# EAGLE schematic VCAMatrix (EAGLE 7.7.0)

## Sheet 1 of 2
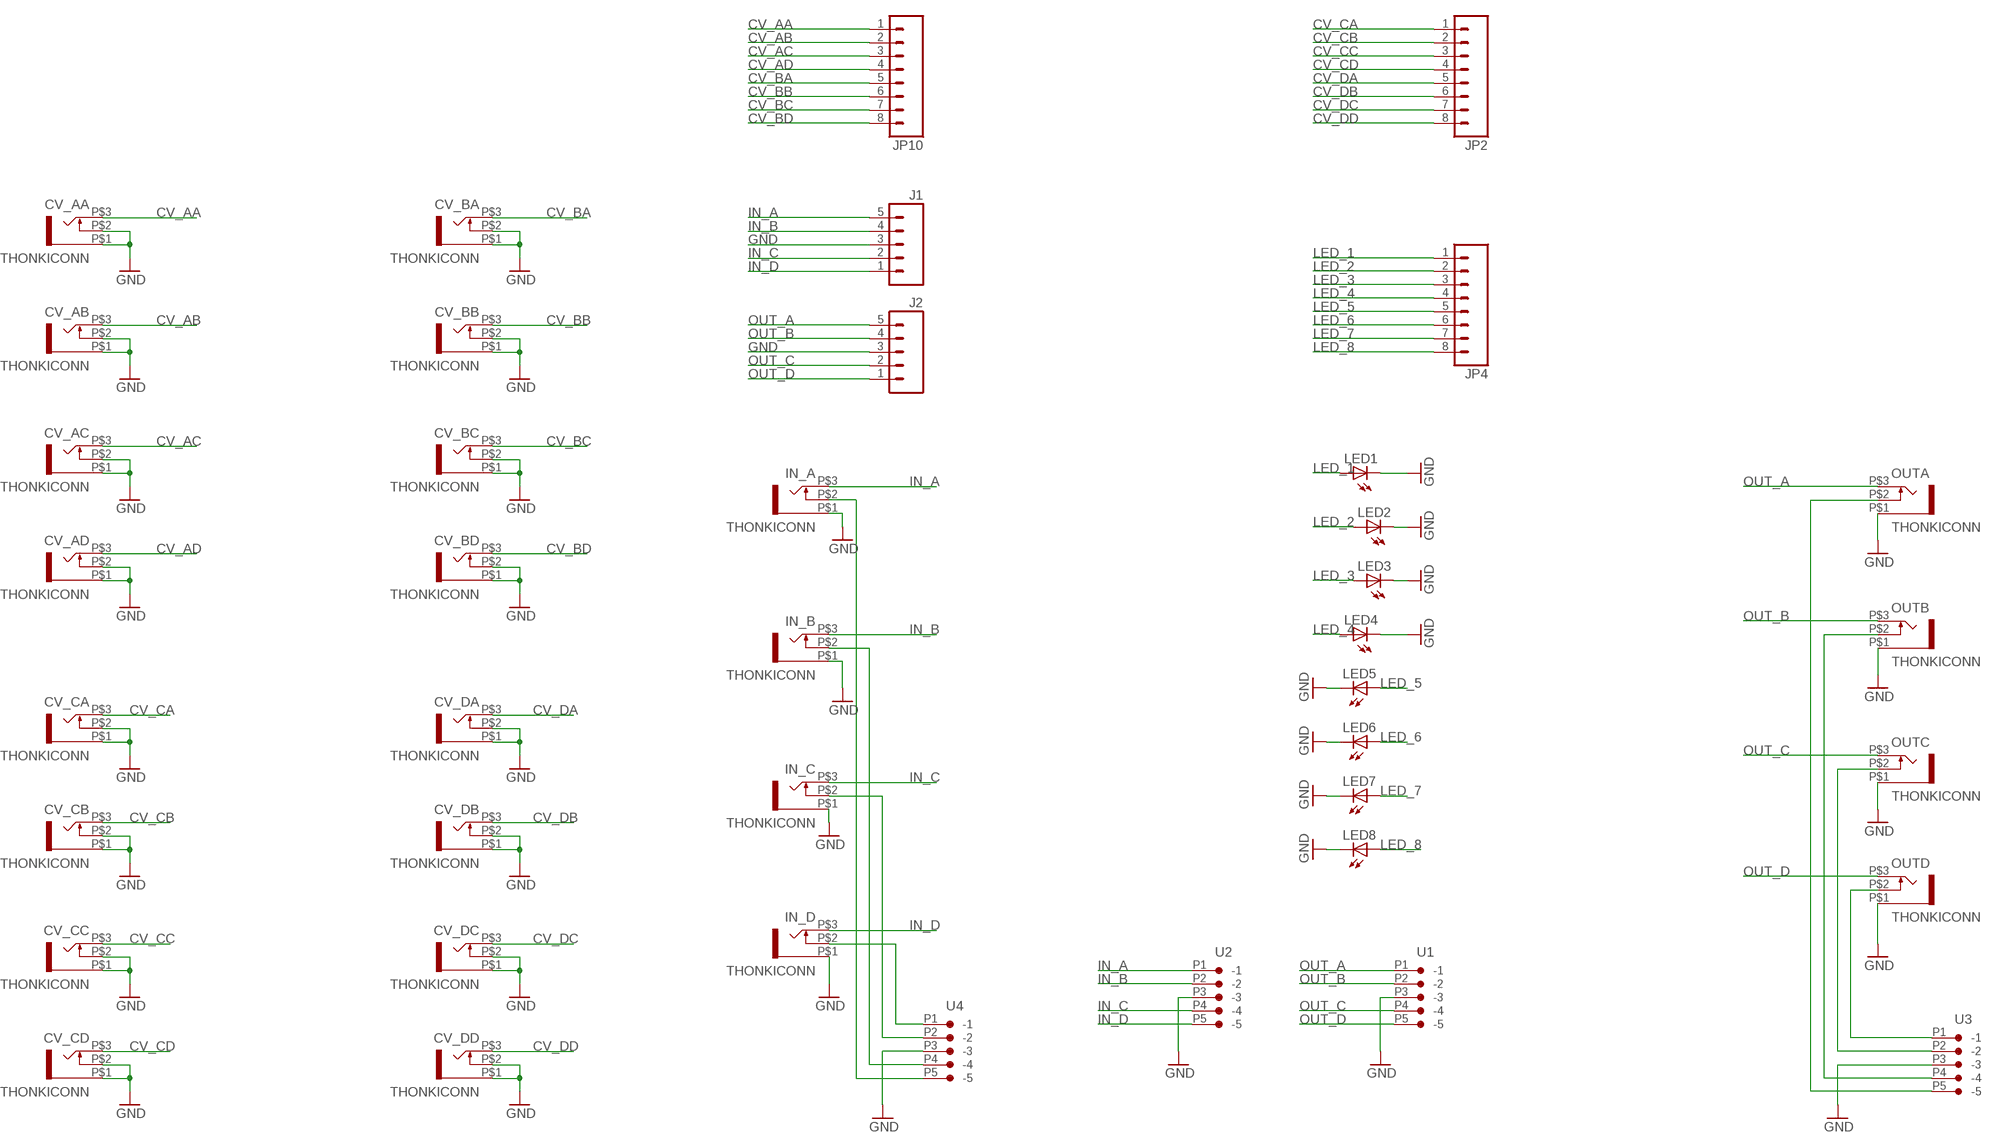
[diagram p0: schematic, sheet 1]

### Parts
CV_AA  THONKICONN  [THONKICONN]
CV_AB  THONKICONN  [THONKICONN]
CV_AC  THONKICONN  [THONKICONN]
CV_AD  THONKICONN  [THONKICONN]
CV_BA  THONKICONN  [THONKICONN]
CV_BB  THONKICONN  [THONKICONN]
CV_BC  THONKICONN  [THONKICONN]
CV_BD  THONKICONN  [THONKICONN]
CV_CA  THONKICONN  [THONKICONN]
CV_CB  THONKICONN  [THONKICONN]
CV_CC  THONKICONN  [THONKICONN]
CV_CD  THONKICONN  [THONKICONN]
CV_DA  THONKICONN  [THONKICONN]
CV_DB  THONKICONN  [THONKICONN]
CV_DC  THONKICONN  [THONKICONN]
CV_DD  THONKICONN  [THONKICONN]
IN_A  THONKICONN  [THONKICONN]
IN_B  THONKICONN  [THONKICONN]
IN_C  THONKICONN  [THONKICONN]
IN_D  THONKICONN  [THONKICONN]
J1  M05PTH  [1X05]
J2  M05PTH  [1X05]
JP2  M081X08  [1X08]
JP4  M081X08  [1X08]
JP10  M081X08  [1X08]
LED1  LED3MM  [LED3MM]
LED2  LED3MM  [LED3MM]
LED3  LED3MM  [LED3MM]
LED4  LED3MM  [LED3MM]
LED5  LED3MM  [LED3MM]
LED6  LED3MM  [LED3MM]
LED7  LED3MM  [LED3MM]
LED8  LED3MM  [LED3MM]
OUTA  THONKICONN  [THONKICONN]
OUTB  THONKICONN  [THONKICONN]
OUTC  THONKICONN  [THONKICONN]
OUTD  THONKICONN  [THONKICONN]
U1  CON-JST_PH_5W  [CON-JST_PH_5W]
U2  CON-JST_PH_5W  [CON-JST_PH_5W]
U3  CON-JST_PH_5W  [CON-JST_PH_5W]
U4  CON-JST_PH_5W  [CON-JST_PH_5W]

### Nets
CV_AA: CV_AA.P$3 JP10.1 ; also sheet 2
CV_AB: CV_AB.P$3 JP10.2 ; also sheet 2
CV_AC: CV_AC.P$3 JP10.3 ; also sheet 2
CV_AD: CV_AD.P$3 JP10.4 ; also sheet 2
CV_BA: CV_BA.P$3 JP10.5 ; also sheet 2
CV_BB: CV_BB.P$3 JP10.6 ; also sheet 2
CV_BC: CV_BC.P$3 JP10.7 ; also sheet 2
CV_BD: CV_BD.P$3 JP10.8 ; also sheet 2
CV_CA: CV_CA.P$3 JP2.1 ; also sheet 2
CV_CB: CV_CB.P$3 JP2.2 ; also sheet 2
CV_CC: CV_CC.P$3 JP2.3 ; also sheet 2
CV_CD: CV_CD.P$3 JP2.4 ; also sheet 2
CV_DA: CV_DA.P$3 JP2.5 ; also sheet 2
CV_DB: CV_DB.P$3 JP2.6 ; also sheet 2
CV_DC: CV_DC.P$3 JP2.7 ; also sheet 2
CV_DD: CV_DD.P$3 JP2.8 ; also sheet 2
GND: CV_AA.P$1 CV_AA.P$2 CV_AB.P$1 CV_AB.P$2 CV_AC.P$1 CV_AC.P$2 CV_AD.P$1 CV_AD.P$2 CV_BA.P$1 CV_BA.P$2 CV_BB.P$1 CV_BB.P$2 CV_BC.P$1 CV_BC.P$2 CV_BD.P$1 CV_BD.P$2 CV_CA.P$1 CV_CA.P$2 CV_CB.P$1 CV_CB.P$2 CV_CC.P$1 CV_CC.P$2 CV_CD.P$1 CV_CD.P$2 CV_DA.P$1 CV_DA.P$2 CV_DB.P$1 CV_DB.P$2 CV_DC.P$1 CV_DC.P$2 CV_DD.P$1 CV_DD.P$2 IN_A.P$1 IN_B.P$1 IN_C.P$1 IN_D.P$1 J1.3 J2.3 LED1.K(C) LED2.K(C) LED3.K(C) LED4.K(C) LED5.K(C) LED6.K(C) LED7.K(C) LED8.K(C) OUTA.P$1 OUTB.P$1 OUTC.P$1 OUTD.P$1 U1.P3(-3) U2.P3(-3) U3.P3(-3) U4.P3(-3) ; also sheet 2
IN_A: IN_A.P$3 J1.5 U2.P1(-1) ; also sheet 2
IN_B: IN_B.P$3 J1.4 U2.P2(-2) ; also sheet 2
IN_C: IN_C.P$3 J1.2 U2.P4(-4) ; also sheet 2
IN_D: IN_D.P$3 J1.1 U2.P5(-5) ; also sheet 2
LED_1: JP4.1 LED1.A ; also sheet 2
LED_2: JP4.2 LED2.A ; also sheet 2
LED_3: JP4.3 LED3.A ; also sheet 2
LED_4: JP4.4 LED4.A ; also sheet 2
LED_5: JP4.5 LED5.A ; also sheet 2
LED_6: JP4.6 LED6.A ; also sheet 2
LED_7: JP4.7 LED7.A ; also sheet 2
LED_8: JP4.8 LED8.A ; also sheet 2
N$55: OUTA.P$2 U3.P5(-5)
N$70: IN_B.P$2 U4.P4(-4)
N$71: IN_C.P$2 U4.P2(-2)
N$72: IN_D.P$2 U4.P1(-1)
N$73: OUTB.P$2 U3.P4(-4)
N$74: OUTC.P$2 U3.P2(-2)
N$75: OUTD.P$2 U3.P1(-1)
N$76: IN_A.P$2 U4.P5(-5)
OUT_A: J2.5 OUTA.P$3 U1.P1(-1) ; also sheet 2
OUT_B: J2.4 OUTB.P$3 U1.P2(-2) ; also sheet 2
OUT_C: J2.2 OUTC.P$3 U1.P4(-4) ; also sheet 2
OUT_D: J2.1 OUTD.P$3 U1.P5(-5) ; also sheet 2

## Sheet 2 of 2
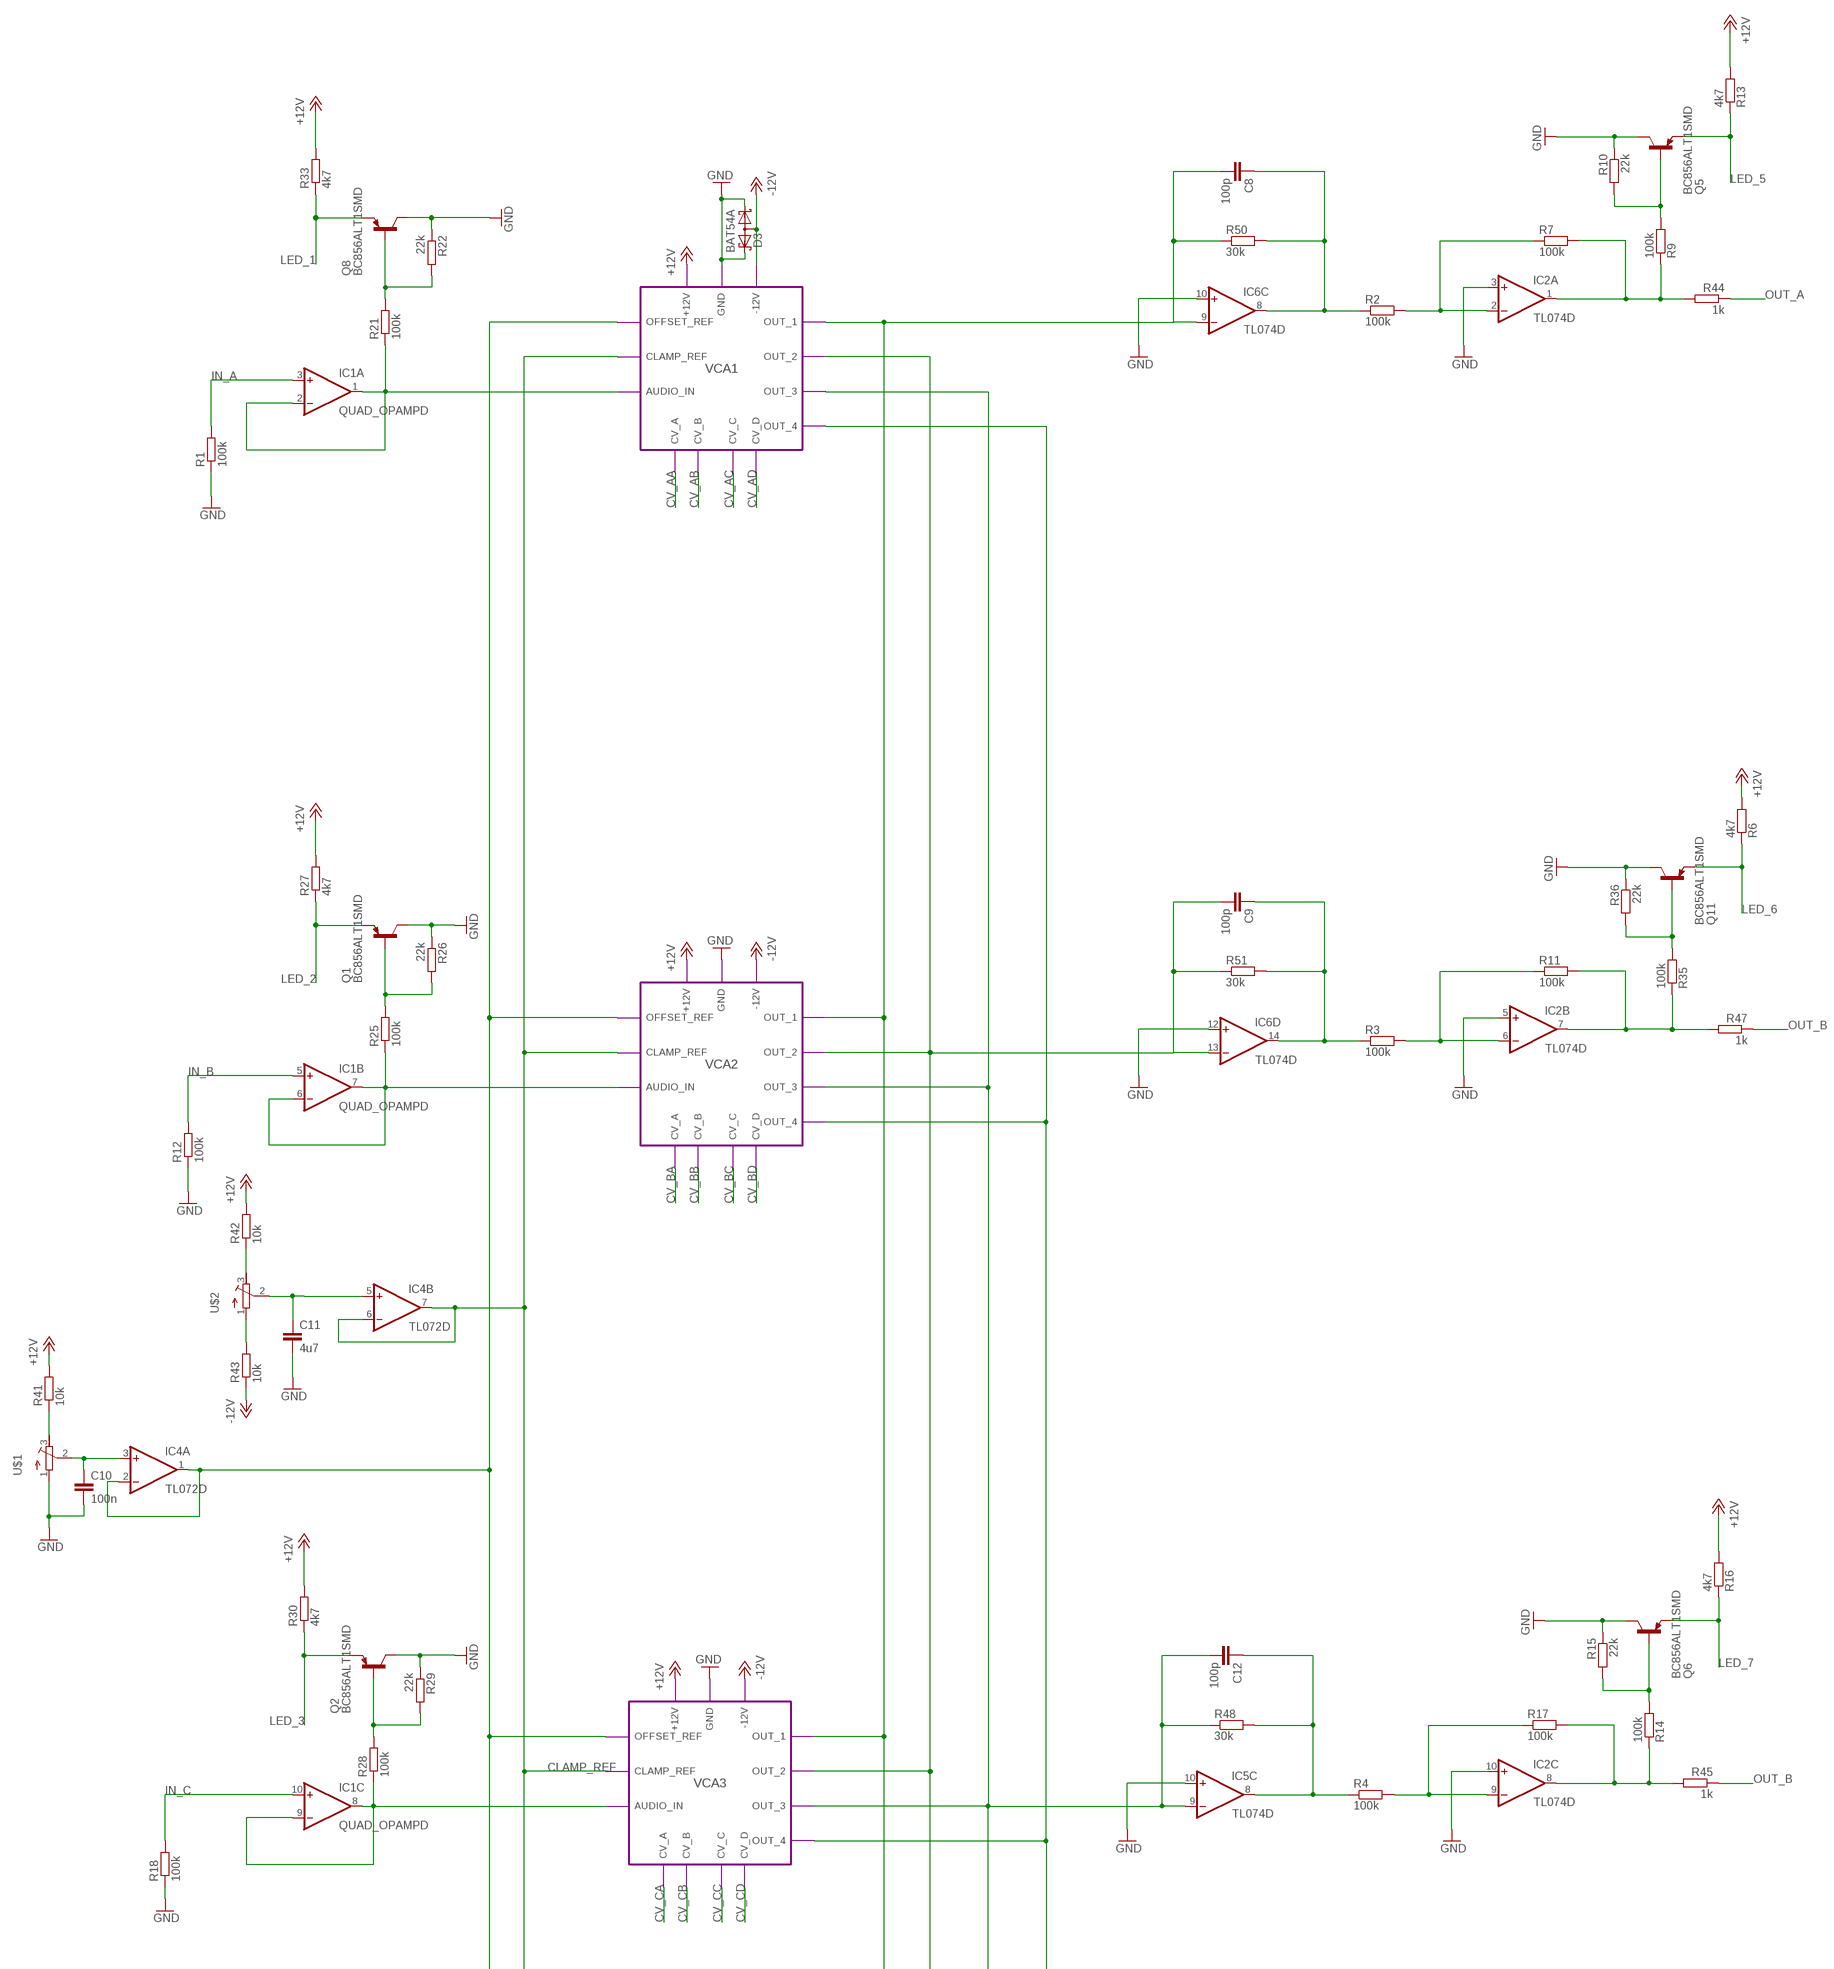
[diagram p1: schematic, sheet 2, part 1 of 2]
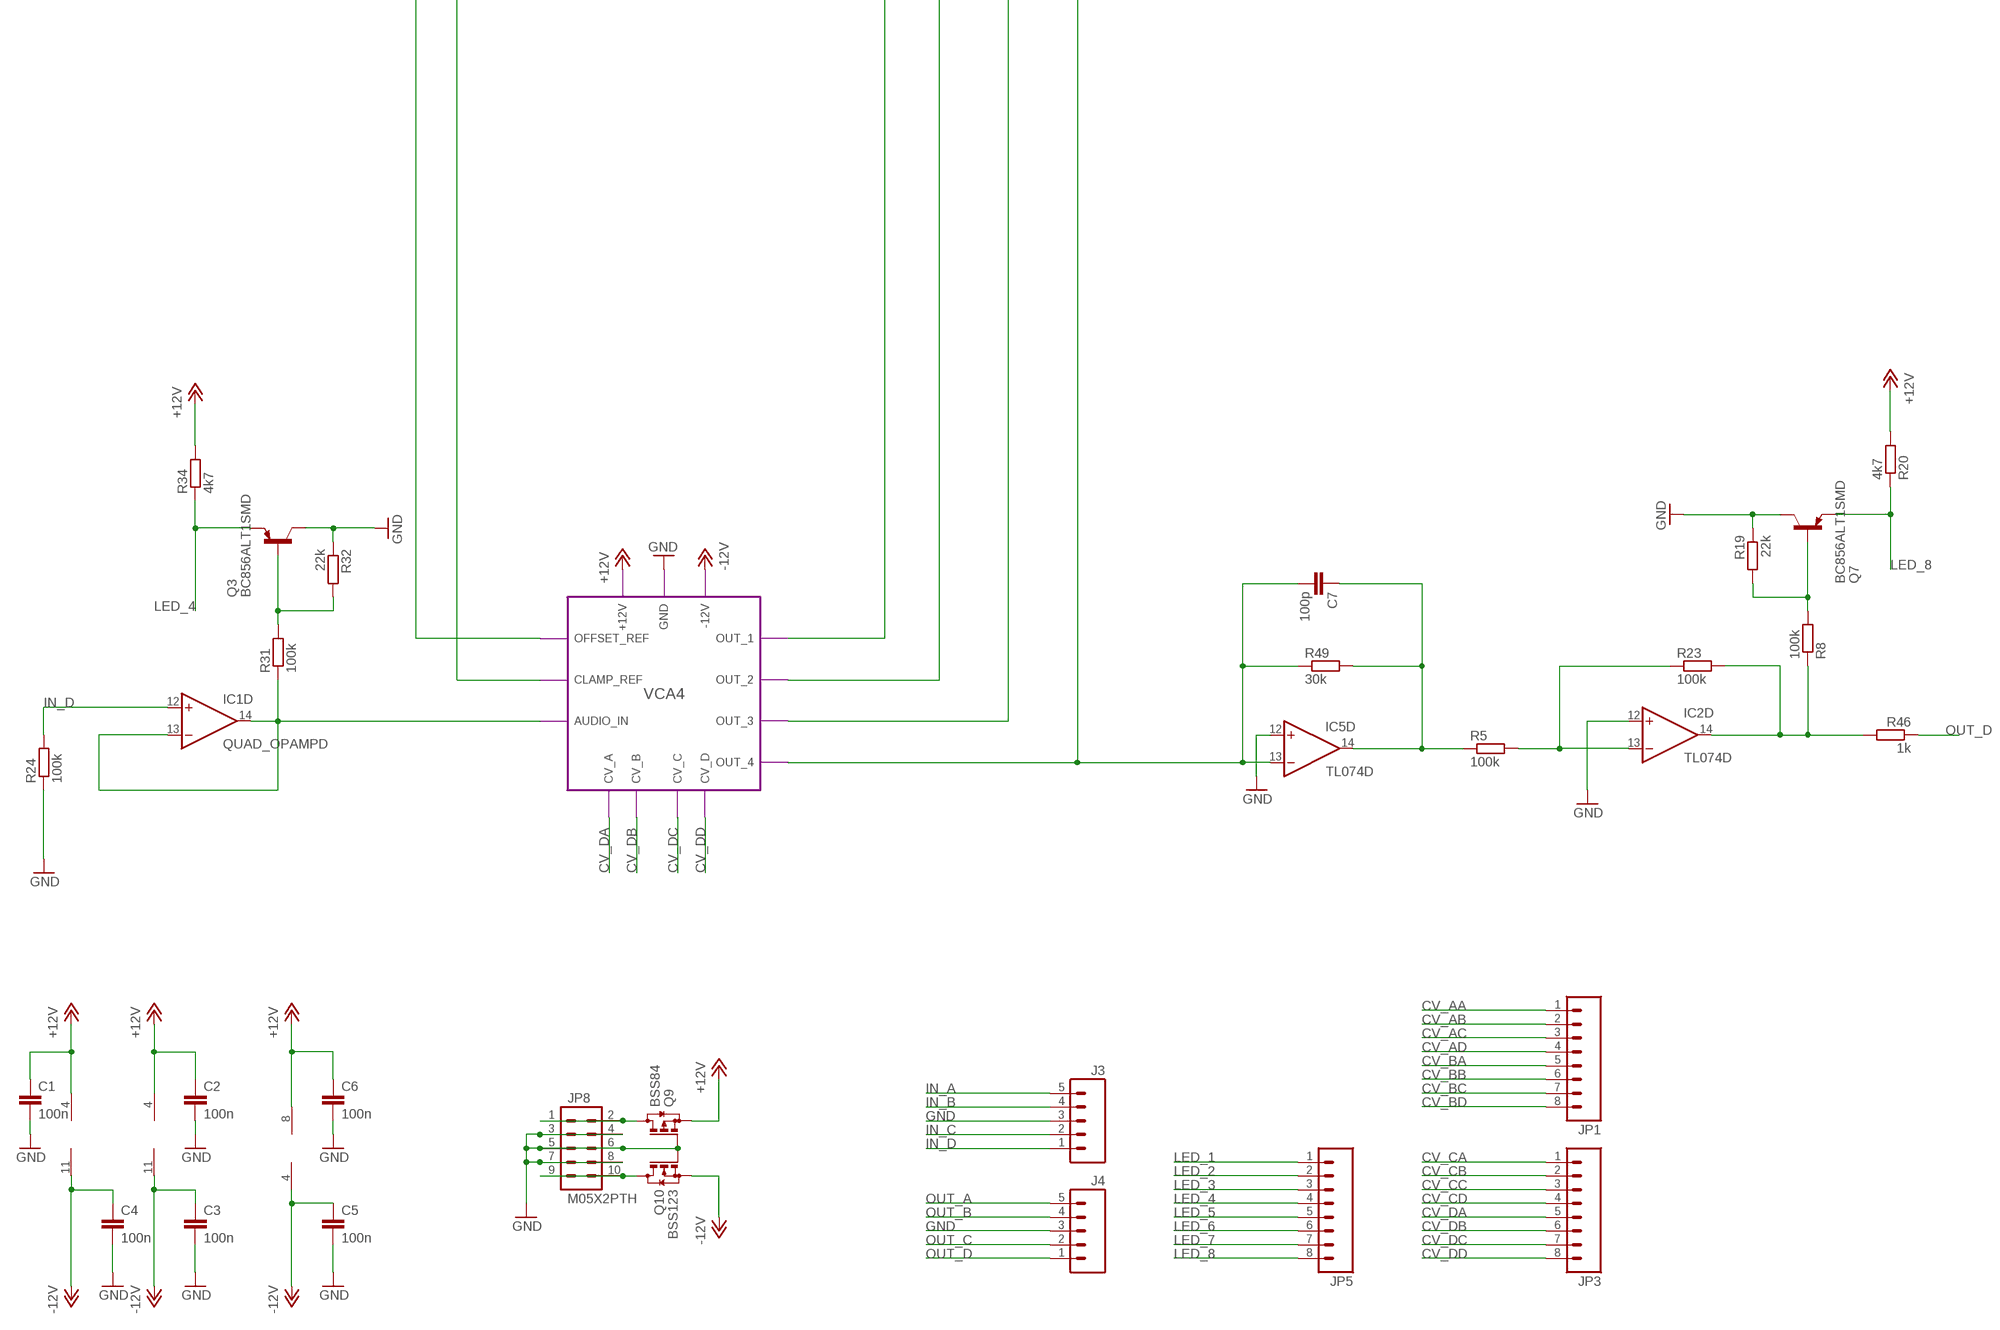
[diagram p2: schematic, sheet 2, part 2 of 2]

### Parts
C1  100n  C-EUC0603K  [C0603K]
C2  100n  C-EUC0603K  [C0603K]
C3  100n  C-EUC0603K  [C0603K]
C4  100n  C-EUC0603K  [C0603K]
C5  100n  C-EUC0603K  [C0603K]
C6  100n  C-EUC0603K  [C0603K]
C7  100p  C-EUC0603K  [C0603K]
C8  100p  C-EUC0603K  [C0603K]
C9  100p  C-EUC0603K  [C0603K]
C10  100n  C-EUC0603K  [C0603K]
C11  4u7  C-EUC0603K  [C0603K]
C12  100p  C-EUC0603K  [C0603K]
D3  BAT54A  [SOT23]
IC1  QUAD_OPAMPD  [SO14]
IC2  TL074D  [SO14]
IC4  TL072D  [SO08]
IC5  TL074D  [SO14]
IC6  TL074D  [SO14]
J3  M05PTH  [1X05]
J4  M05PTH  [1X05]
JP1  M081X08  [1X08]
JP3  M081X08  [1X08]
JP5  M081X08  [1X08]
JP8  M05X2PTH  [AVR_ICSP]
Q1  BC856ALT1SMD  [SOT23-BEC]
Q2  BC856ALT1SMD  [SOT23-BEC]
Q3  BC856ALT1SMD  [SOT23-BEC]
Q5  BC856ALT1SMD  [SOT23-BEC]
Q6  BC856ALT1SMD  [SOT23-BEC]
Q7  BC856ALT1SMD  [SOT23-BEC]
Q8  BC856ALT1SMD  [SOT23-BEC]
Q9  BSS84  [SOT23]
Q10  BSS123  [SOT23]
Q11  BC856ALT1SMD  [SOT23-BEC]
R1  100k  R-EU_0603  [0603]
R2  100k  R-EU_0603  [0603]
R3  100k  R-EU_0603  [0603]
R4  100k  R-EU_0603  [0603]
R5  100k  R-EU_0603  [0603]
R6  4k7  R-EU_0603  [0603]
R7  100k  R-EU_0603  [0603]
R8  100k  R-EU_0603  [0603]
R9  100k  R-EU_0603  [0603]
R10  22k  R-EU_0603  [0603]
R11  100k  R-EU_0603  [0603]
R12  100k  R-EU_0603  [0603]
R13  4k7  R-EU_0603  [0603]
R14  100k  R-EU_0603  [0603]
R15  22k  R-EU_0603  [0603]
R16  4k7  R-EU_0603  [0603]
R17  100k  R-EU_0603  [0603]
R18  100k  R-EU_0603  [0603]
R19  22k  R-EU_0603  [0603]
R20  4k7  R-EU_0603  [0603]
R21  100k  R-EU_0603  [0603]
R22  22k  R-EU_0603  [0603]
R23  100k  R-EU_0603  [0603]
R24  100k  R-EU_0603  [0603]
R25  100k  R-EU_0603  [0603]
R26  22k  R-EU_0603  [0603]
R27  4k7  R-EU_0603  [0603]
R28  100k  R-EU_0603  [0603]
R29  22k  R-EU_0603  [0603]
R30  4k7  R-EU_0603  [0603]
R31  100k  R-EU_0603  [0603]
R32  22k  R-EU_0603  [0603]
R33  4k7  R-EU_0603  [0603]
R34  4k7  R-EU_0603  [0603]
R35  100k  R-EU_0603  [0603]
R36  22k  R-EU_0603  [0603]
R41  10k  R-EU_0603  [0603]
R42  10k  R-EU_0603  [0603]
R43  10k  R-EU_0603  [0603]
R44  1k  R-EU_0603  [0603]
R45  1k  R-EU_0603  [0603]
R46  1k  R-EU_0603  [0603]
R47  1k  R-EU_0603  [0603]
R48  30k  R-EU_0603  [0603]
R49  30k  R-EU_0603  [0603]
R50  30k  R-EU_0603  [0603]
R51  30k  R-EU_0603  [0603]
U$1  R-TRIMM64W  [RTRIM64W]
U$2  R-TRIMM64W  [RTRIM64W]

### Module instances
VCA1 = VCA
VCA2 = VCA
VCA3 = VCA
VCA4 = VCA

### Nets
+12V: C1.1 C2.1 C6.1 IC1.4(P:V+) IC2.4(P:V+) IC4.8(P:V+) Q9.2(S) R6.2 R13.2 R16.2 R20.2 R27.2 R30.2 R33.2 R34.2 R41.2 R42.2 ; port VCA1.+12V VCA2.+12V VCA3.+12V VCA4.+12V
-12V: C3.1 C4.1 C5.1 D3.3(AA) IC1.11(P:V-) IC2.11(P:V-) IC4.4(P:V-) Q10.2(S) R43.1 ; port VCA1.-12V VCA2.-12V VCA3.-12V VCA4.-12V
CLAMP_REF: IC4.6(B:-IN) IC4.7(B:OUT) ; port VCA4.CLAMP_REF VCA3.CLAMP_REF VCA2.CLAMP_REF VCA1.CLAMP_REF
CV_AA: JP1.1 ; port VCA1.CV_A ; also sheet 1
CV_AB: JP1.2 ; port VCA1.CV_B ; also sheet 1
CV_AC: JP1.3 ; port VCA1.CV_C ; also sheet 1
CV_AD: JP1.4 ; port VCA1.CV_D ; also sheet 1
CV_BA: JP1.5 ; port VCA2.CV_A ; also sheet 1
CV_BB: JP1.6 ; port VCA2.CV_B ; also sheet 1
CV_BC: JP1.7 ; port VCA2.CV_C ; also sheet 1
CV_BD: JP1.8 ; port VCA2.CV_D ; also sheet 1
CV_CA: JP3.1 ; port VCA3.CV_A ; also sheet 1
CV_CB: JP3.2 ; port VCA3.CV_B ; also sheet 1
CV_CC: JP3.3 ; port VCA3.CV_C ; also sheet 1
CV_CD: JP3.4 ; port VCA3.CV_D ; also sheet 1
CV_DA: JP3.5 ; port VCA4.CV_A ; also sheet 1
CV_DB: JP3.6 ; port VCA4.CV_B ; also sheet 1
CV_DC: JP3.7 ; port VCA4.CV_C ; also sheet 1
CV_DD: JP3.8 ; port VCA4.CV_D ; also sheet 1
GND: C1.2 C2.2 C3.2 C4.2 C5.2 C6.2 C10.2 C11.2 D3.1(K1) D3.2(K2) IC2.3(A:+IN) IC2.5(B:+IN) IC2.10(C:+IN) IC2.12(D:+IN) IC5.10(C:+IN) IC5.12(D:+IN) IC6.10(C:+IN) IC6.12(D:+IN) J3.3 J4.3 JP8.3 JP8.4 JP8.5 JP8.6 JP8.7 JP8.8 Q1.C Q2.C Q3.C Q5.C Q6.C Q7.C Q8.C Q9.1(G) Q10.1(G) Q11.C R1.1 R10.1 R12.1 R15.1 R18.1 R19.1 R22.1 R24.1 R26.1 R29.1 R32.1 R36.1 U$1.1(A) ; port VCA1.GND VCA2.GND VCA3.GND VCA4.GND ; also sheet 1
IN_A: IC1.3(A:+IN) J3.5 R1.2 ; also sheet 1
IN_B: IC1.5(B:+IN) J3.4 R12.2 ; also sheet 1
IN_C: IC1.10(C:+IN) J3.2 R18.2 ; also sheet 1
IN_D: IC1.12(D:+IN) J3.1 R24.2 ; also sheet 1
LED_1: JP5.1 Q8.E R33.1 ; also sheet 1
LED_2: JP5.2 Q1.E R27.1 ; also sheet 1
LED_3: JP5.3 Q2.E R30.1 ; also sheet 1
LED_4: JP5.4 Q3.E R34.1 ; also sheet 1
LED_5: JP5.5 Q5.E R13.1 ; also sheet 1
LED_6: JP5.6 Q11.E R6.1 ; also sheet 1
LED_7: JP5.7 Q6.E R16.1 ; also sheet 1
LED_8: JP5.8 Q7.E R20.1 ; also sheet 1
N$1: IC2.2(A:-IN) R2.2 R7.1
N$2: IC2.6(B:-IN) R3.2 R11.1
N$3: IC1.6(B:-IN) IC1.7(B:OUT) R25.1 ; port VCA2.AUDIO_IN
N$4: Q1.B R25.2 R26.2
N$5: JP8.9 JP8.10 Q10.3(D)
N$6: Q5.B R9.2 R10.2
N$7: Q6.B R14.2 R15.2
N$8: Q7.B R8.2 R19.2
N$9: C8.2 IC6.9(C:-IN) R50.1 ; port VCA1.OUT_1 VCA2.OUT_1 VCA3.OUT_1 VCA4.OUT_1
N$10: C9.2 IC6.13(D:-IN) R51.1 ; port VCA4.OUT_2 VCA3.OUT_2 VCA2.OUT_2 VCA1.OUT_2
N$11: IC2.9(C:-IN) R4.2 R17.1
N$12: Q8.B R21.2 R22.2
N$13: R41.1 U$1.3(E)
N$14: C12.2 IC5.9(C:-IN) R48.1 ; port VCA1.OUT_3 VCA2.OUT_3 VCA3.OUT_3 VCA4.OUT_3
N$15: Q2.B R28.2 R29.2
N$16: C7.2 IC5.13(D:-IN) R49.1 ; port VCA4.OUT_4 VCA3.OUT_4 VCA2.OUT_4 VCA1.OUT_4
N$17: Q3.B R31.2 R32.2
N$18: C10.1 IC4.3(A:+IN) U$1.2(S)
N$20: C11.1 IC4.5(B:+IN) U$2.2(S)
N$22: IC1.13(D:-IN) IC1.14(D:OUT) R31.1 ; port VCA4.AUDIO_IN
N$23: IC1.8(C:OUT) IC1.9(C:-IN) R28.1 ; port VCA3.AUDIO_IN
N$34: IC4.1(A:OUT) IC4.2(A:-IN) ; port VCA4.OFFSET_REF VCA3.OFFSET_REF VCA2.OFFSET_REF VCA1.OFFSET_REF
N$44: R42.1 U$2.3(E)
N$45: Q11.B R35.2 R36.2
N$47: IC2.13(D:-IN) R5.2 R23.1
N$77: R43.2 U$2.1(A)
N$79: JP8.1 JP8.2 Q9.3(D)
N$82: IC1.1(A:OUT) IC1.2(A:-IN) R21.1 ; port VCA1.AUDIO_IN
OUT_A: C8.1 IC6.8(C:OUT) J4.5 R2.1 R44.1 R50.2 ; also sheet 1
OUT_B: C9.1 IC6.14(D:OUT) J4.4 R3.1 R45.1 R47.1 R51.2 ; also sheet 1
OUT_C: C12.1 IC5.8(C:OUT) J4.2 R4.1 R48.2 ; also sheet 1
OUT_D: C7.1 IC5.14(D:OUT) J4.1 R5.1 R46.1 R49.2 ; also sheet 1
OUTPUT_A: IC2.1(A:OUT) R7.2 R9.1 R44.2
OUTPUT_B: IC2.7(B:OUT) R11.2 R35.1 R47.2
OUTPUT_C: IC2.8(C:OUT) R14.1 R17.2 R45.2
OUTPUT_D: IC2.14(D:OUT) R8.1 R23.2 R46.2
Unconnected: IC5.1(A:OUT) IC5.2(A:-IN) IC5.3(A:+IN) IC5.5(B:+IN) IC5.6(B:-IN) IC5.7(B:OUT) IC6.1(A:OUT) IC6.2(A:-IN) IC6.3(A:+IN) IC6.5(B:+IN) IC6.6(B:-IN) IC6.7(B:OUT)

## Power pins joined to a net without a drawn wire
V+: IC5.4(P:V+) IC6.4(P:V+)
V-: IC5.11(P:V-) IC6.11(P:V-)

## Library data of the parts
C1-C6 = Rebel:C-EU: CAPACITOR, European symbol
C7-C12 = resistor:C-EU: CAPACITOR, European symbol
CV_AA CV_AB CV_AC CV_AD CV_BA CV_BB CV_BC CV_BD CV_CA CV_CB CV_CC CV_CD CV_DA CV_DB CV_DC CV_DD IN_A IN_B IN_C IN_D OUTA OUTB OUTC OUTD = Rebel:THONKICONN
D3 = diode:BAT54A: Schottky Diodes Source: Fairchild .. BAT54.pdf
IC1 = adafruit:QUAD_OPAMP: OP AMP Standard quad package
IC2 IC5 IC6 = linear:TL074: OP AMP
IC4 = linear:TL072: OP AMP
J1-J4 = SparkFun-Connectors:M05: Header 5 Standard 5-pin 0.1" header. Use with straight break away headers (SKU : PRT-00116), right angle break away headers (PRT-00553), swiss pins (PRT-00743), machine pins (PRT-00117), and female headers (PRT-00115). Molex polarized connector foot print use with SKU : PRT-08230 with associated crimp pins and housings.
JP1-JP5 JP10 = SparkFun:M08: Header 8 Standard 8-pin 0.1" header. Use with straight break away headers (SKU : PRT-00116), right angle break away headers (PRT-00553), swiss pins (PRT-00743), machine pins (PRT-00117), and female headers (PRT-00115).
JP8 = SparkFun:M05X2: Header 5x2 Standard 10-pin dual row 0.1" header. Commonly used with AVR-ISP. Use with Spark Fun Electronics SKU: PRT-00778
LED1-LED8 = adafruit:LED: LED OSRAM: - CHIPLED LG R971, LG N971, LY N971, LG Q971, LY Q971, LO R971, LY R971 LH N974, LH R974 LS Q976, LO Q976, LY Q976 LO Q996 - Hyper CHIPLED LW Q18S LB Q993, LB Q99A, LB R99A - SideLED LS A670, LO A670, LY A670, LG A670, LP A670 LB A673, LV A673, LT A673, LW A673 LH A674 LY A675 LS A676, LA A676, LO A676, LY A676, LW A676 LS A679, LY A679, LG A679 - Hyper Micro SIDELED® LS Y876, LA Y876, LO Y876, LY Y876 LT Y87S - SmartLED LW L88C, LW L88S LB L89C, LB L89S, LG L890 LS L89K, LO L89K, LY L89K LS L896, LA L896, LO L896, LY L896 - TOPLED LS T670, LO T670, LY T670, LG T670, LP T670 LSG T670, LSP T670, LSY T670, LOP T670, LYG T670 LG T671, LOG T671, LSG T671 LB T673, LV T673, LT T673, LW T673 LH T674 LS T676, LA T676, LO T676, LY T676, LB T676, LH T676, LSB T676, LW T676 LB T67C, LV T67C, LT T67C, LS T67K, LO T67K, LY T67K, LW E67C LS E67B, LA E67B, LO E67B, LY E67B, LB E67C, LV E67C, LT E67C LW T67C LS T679, LY T679, LG T679 LS T770, LO T770, LY T770, LG T770, LP T770 LB T773, LV T773, LT T773, LW T773 LH T774 LS E675, LA E675, LY E675, LS T675 LS T776, LA T776, LO T776, LY T776, LB T776 LHGB T686 LT T68C, LB T68C - Hyper Mini TOPLED® LB M676 - Mini TOPLED Santana® LG M470 LS M47K, LO M47K, LY M47K Source: http://www.osram.convergy.de/
Q1-Q3 Q5-Q8 Q11 = transistor-pnp:BC856*: PNP Transistror
Q9 = transistor-small-signal:BSS84: P-CHANNEL MOS FET; OC_FARNELL: 1779264
Q10 = transistor-small-signal:BSS123: N-CHANNEL MOS FET; OC_FARNELL: 1843725
R1-R36 R41-R51 = Rebel:R-EU_: RESISTOR, European symbol
U1-U4 = Rebel:CON-JST_PH_5W
U$1 U$2 = resistor:R-TRIMM: Trimm resistor

## Module VCA
Ports: AUDIO_IN(in) CV_A(in) CV_B(in) CV_C(in) CV_D(in) +12V(pwr) -12V(pwr) GND(pwr) OFFSET_REF(in) CLAMP_REF(io) OUT_1(out) OUT_2(out) OUT_3(out) OUT_4(out)
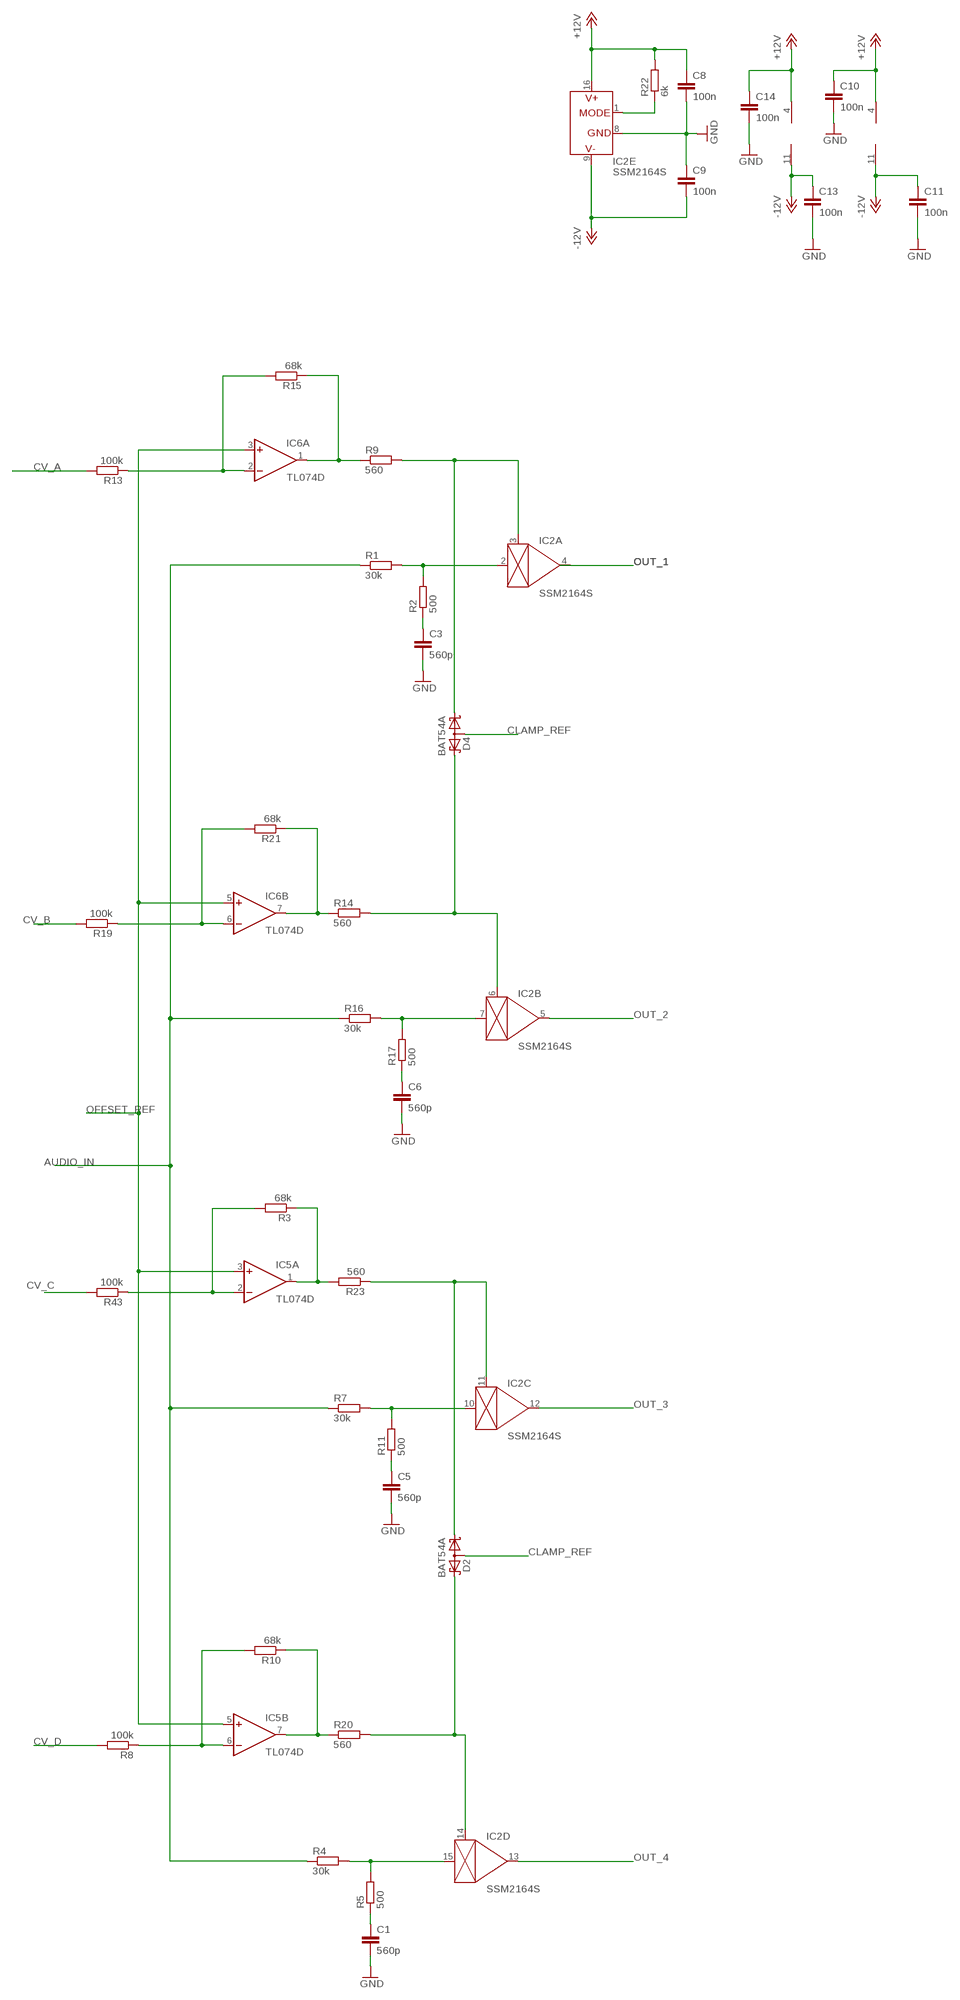
[diagram p3: schematic, module VCA, sheet 1]

### Parts
C1  560p  C-EUC0603K  [C0603K]
C3  560p  C-EUC0603K  [C0603K]
C5  560p  C-EUC0603K  [C0603K]
C6  560p  C-EUC0603K  [C0603K]
C8  100n  C-EUC0603K  [C0603K]
C9  100n  C-EUC0603K  [C0603K]
C10  100n  C-EUC0603K  [C0603K]
C11  100n  C-EUC0603K  [C0603K]
C13  100n  C-EUC0603K  [C0603K]
C14  100n  C-EUC0603K  [C0603K]
D2  BAT54A  [SOT23]
D4  BAT54A  [SOT23]
IC2  SSM2164S  [SOIC16N]
IC5  TL074D  [SO14]
IC6  TL074D  [SO14]
R1  30k  R-EU_0603  [0603]
R2  500  R-EU_0603  [0603]
R3  68k  R-EU_0603  [0603]
R4  30k  R-EU_0603  [0603]
R5  500  R-EU_0603  [0603]
R7  30k  R-EU_0603  [0603]
R8  100k  R-EU_0603  [0603]
R9  560  R-EU_0603  [0603]
R10  68k  R-EU_0603  [0603]
R11  500  R-EU_0603  [0603]
R13  100k  R-EU_0603  [0603]
R14  560  R-EU_0603  [0603]
R15  68k  R-EU_0603  [0603]
R16  30k  R-EU_0603  [0603]
R17  500  R-EU_0603  [0603]
R19  100k  R-EU_0603  [0603]
R20  560  R-EU_0603  [0603]
R21  68k  R-EU_0603  [0603]
R22  6k  R-EU_0603  [0603]
R23  560  R-EU_0603  [0603]
R43  100k  R-EU_0603  [0603]

### Nets
+12V: C8.1 C10.1 C14.1 IC2.16(E:V+) IC5.4(P:V+) IC6.4(P:V+) R22.2
-12V: C9.2 C11.1 C13.1 IC2.9(E:V-) IC5.11(P:V-) IC6.11(P:V-)
AUDIO_IN: R1.1 R4.1 R7.1 R16.1
CLAMP_REF: D2.3(AA) D4.3(AA)
CV_A: R13.2
CV_B: R19.2
CV_C: R43.2
CV_D: R8.2
GND: C1.2 C3.2 C5.2 C6.2 C8.2 C9.1 C10.2 C11.2 C13.2 C14.2 IC2.8(E:GND)
IC2_1: IC5.7(B:OUT) R10.1 R20.1
IC2_2: IC5.6(B:-IN) R8.1 R10.2
IC2_3: IC6.1(A:OUT) R9.1 R15.1
IC2_4: IC5.2(A:-IN) R3.2 R43.1
IC2_5: IC6.2(A:-IN) R13.1 R15.2
IC2_6: IC6.7(B:OUT) R14.1 R21.1
IC2_7: IC6.6(B:-IN) R19.1 R21.2
IC2_11: IC5.1(A:OUT) R3.1 R23.2
N$1: D4.1(K1) IC2.3(A:CTRL) R9.2
N$2: C1.1 R5.1
N$3: C3.1 R2.1
N$4: IC2.15(D:IN) R4.2 R5.2
N$5: IC2.2(A:IN) R1.2 R2.2
N$7: D4.2(K2) IC2.6(B:CTRL) R14.2
N$8: D2.1(K1) IC2.11(C:CTRL) R23.1
N$11: C6.1 R17.1
N$12: IC2.7(B:IN) R16.2 R17.2
N$14: D2.2(K2) IC2.14(D:CTRL) R20.2
N$17: IC2.1(E:MODE) R22.1
N$19: C5.1 R11.1
N$23: IC2.10(C:IN) R7.2 R11.2
OFFSET_REF: IC5.3(A:+IN) IC5.5(B:+IN) IC6.3(A:+IN) IC6.5(B:+IN)
OUT_2: IC2.5(B:OUT)
OUT_3: IC2.12(C:OUT)
OUT_4: IC2.13(D:OUT)
Unconnected: IC2.4(A:OUT) IC5.8(C:OUT) IC5.9(C:-IN) IC5.10(C:+IN) IC5.12(D:+IN) IC5.13(D:-IN) IC5.14(D:OUT) IC6.8(C:OUT) IC6.9(C:-IN) IC6.10(C:+IN) IC6.12(D:+IN) IC6.13(D:-IN) IC6.14(D:OUT)

### Library data of the parts
C1 C3 C5 C6 = resistor:C-EU: CAPACITOR, European symbol
C8-C11 C13 C14 = Rebel:C-EU: CAPACITOR, European symbol
D2 D4 = diode:BAT54A: Schottky Diodes Source: Fairchild .. BAT54.pdf
IC2 = ssm2164:SSM2164
IC5 IC6 = linear:TL074: OP AMP
R1-R5 R7-R11 R13-R17 R19-R23 R43 = Rebel:R-EU_: RESISTOR, European symbol